# EasyEDA schematic GreenHouse BOX.json
TITLE: Sheet_1; REV: 1.0; Date: 2021-05-11; Sheet: 1/1; Company: Your Company
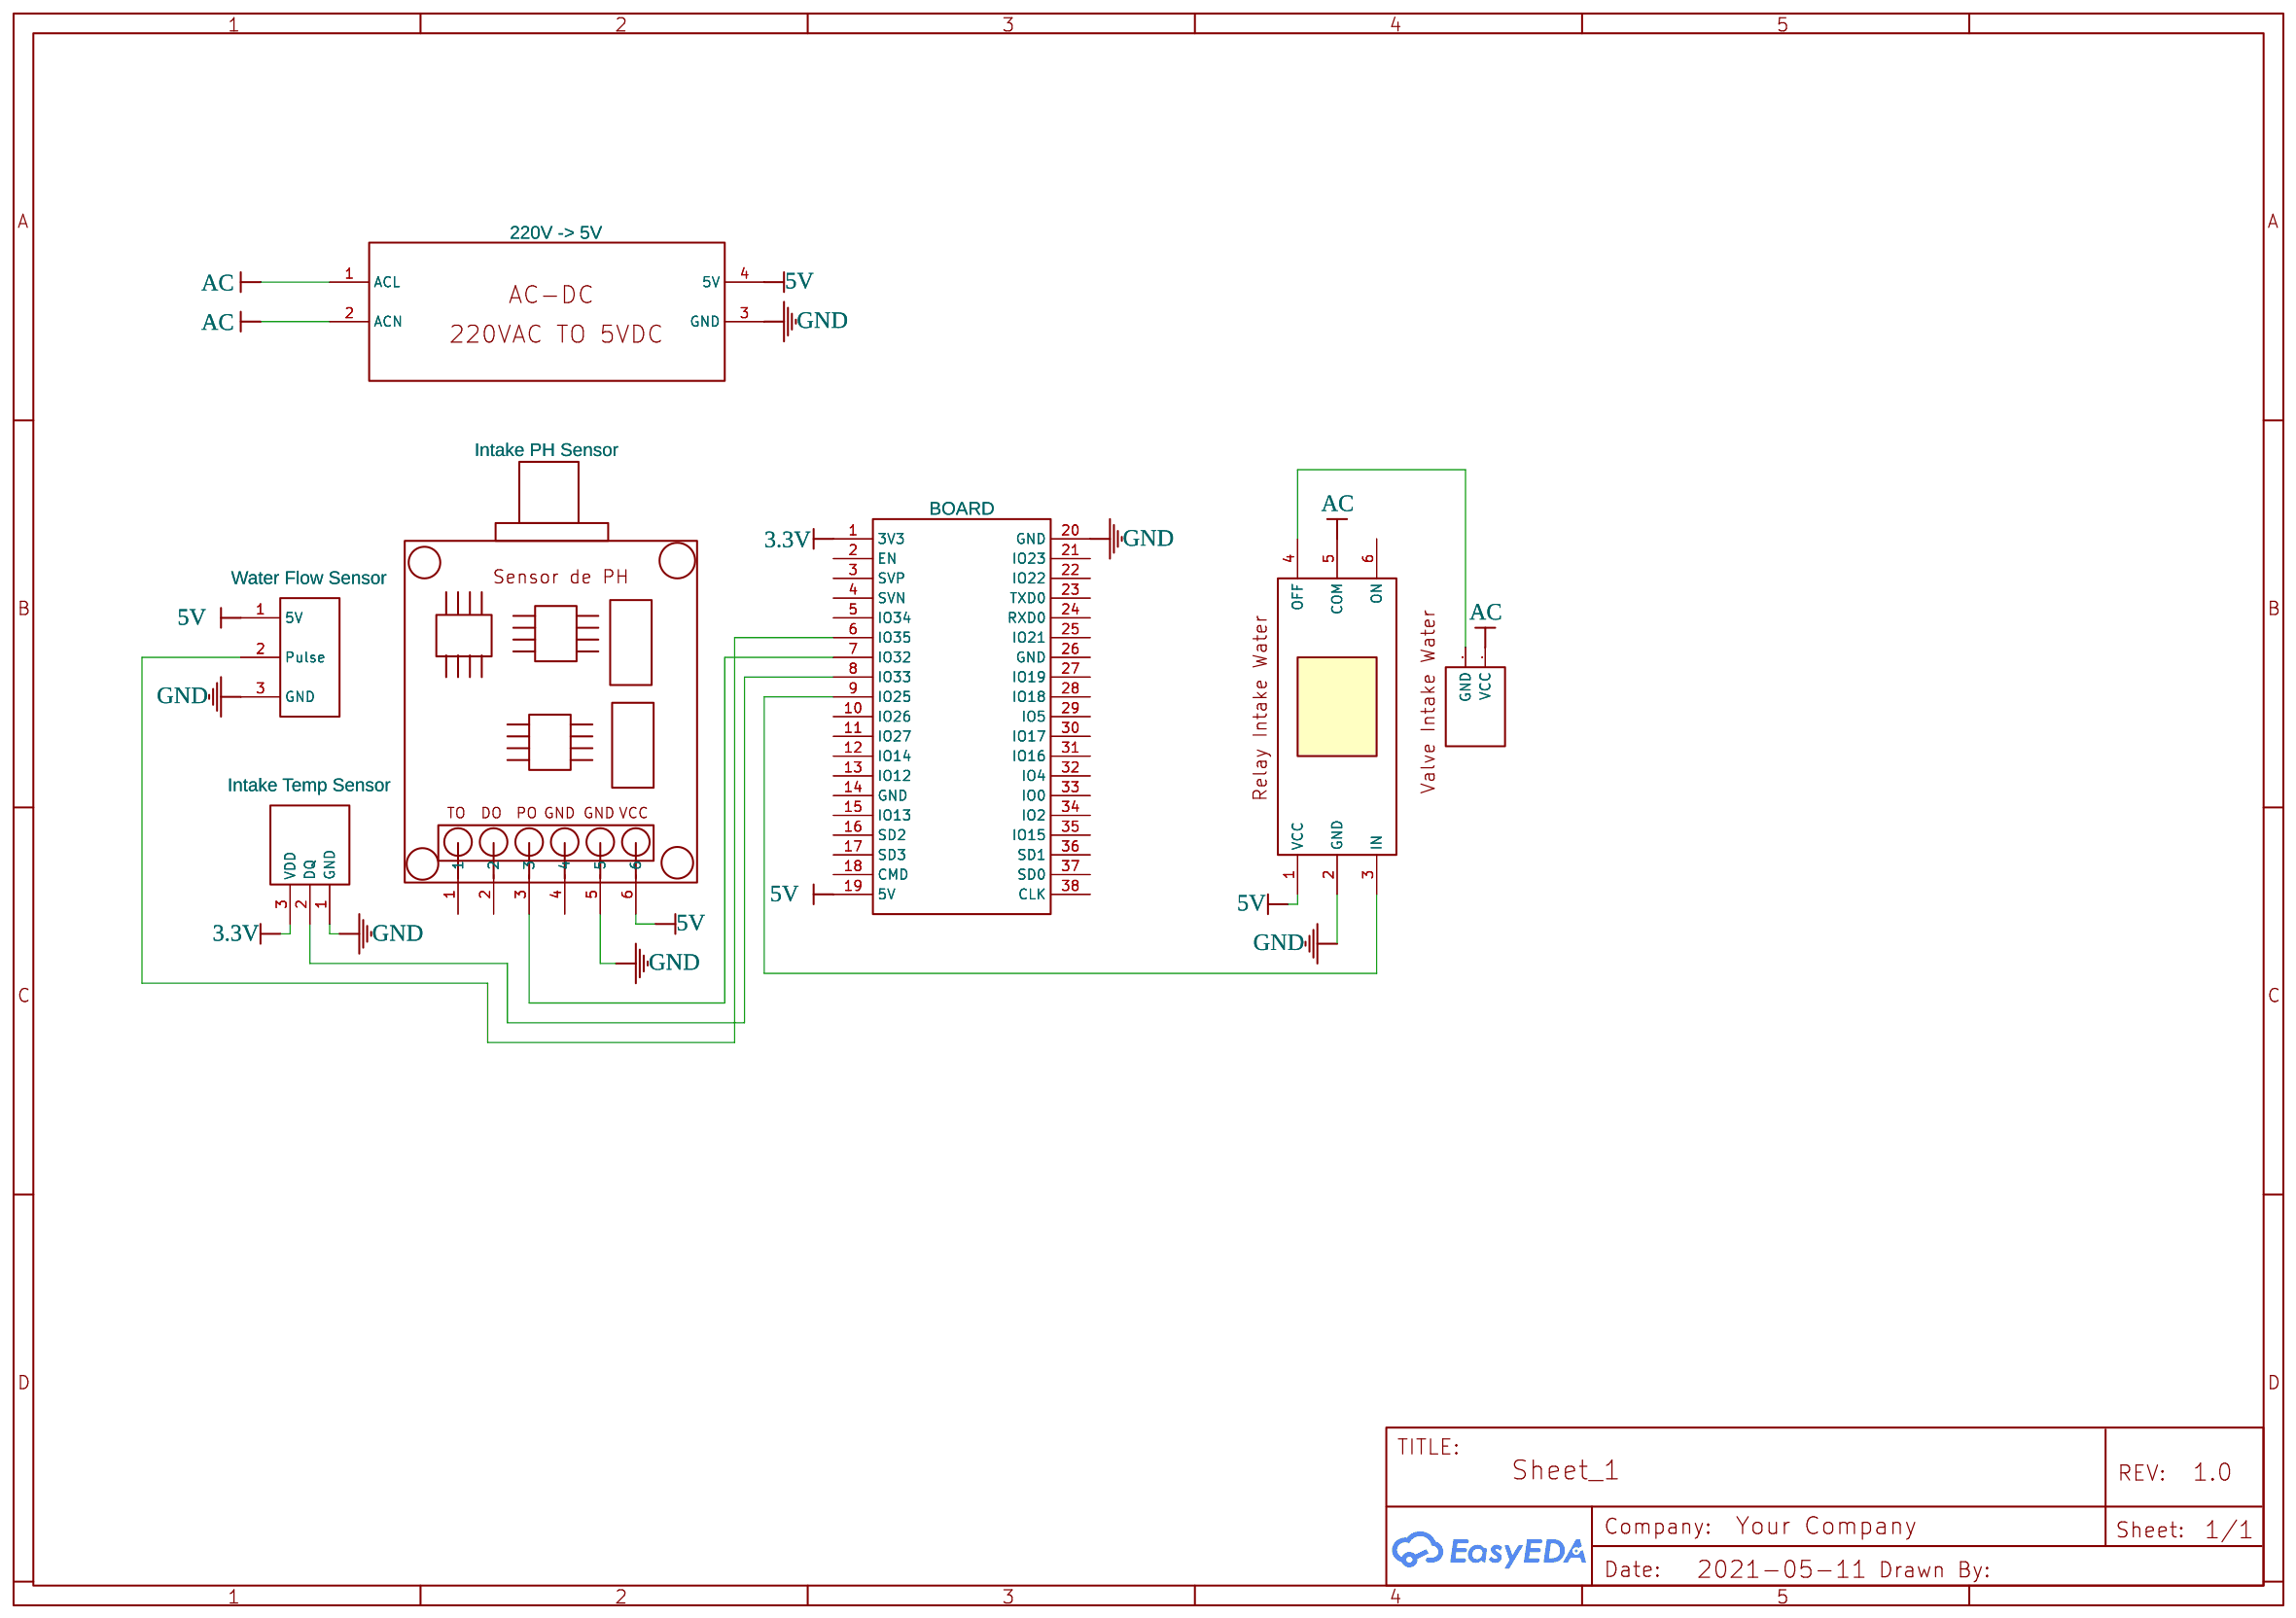
[diagram p0: schematic sheet]

## Parts
BOARD  ESP32  [ESP32]
BT1FF  Intake Temp Sensor  [DS18B20 (TO-92) 3PIN EASY PLANT]
P1  Solenoid Valve  [SOLENOID VALVE]
U1  Intake PH Sensor  [1X6_2.54MM_HEADER_AVR_ISP]
U2  220V -> 5V  [220VAC_TO_5VDC]
U3  Arduino Relay 5V 1CH 2LED  [ARDUINO RELAY 5V 1CH 2LED]
U4  Water Flow Sensor  [WATER_FLOW_SENSOR]

## Library data of the parts
BOARD = ESP32: Contributor: Ariusz
BT1FF = DS18B20: Supplier: LCSC; Manufacturer: MAXIM; Manufacturer Part: DS18B20+; image: //image.lceda.cn/szlcsc/C9753.jpg; Supplier Part: C9753; Contributor: 陳詩函
P1 = Solenoid Valve: Supplier Part: C49257; Manufacturer: BOOMELE; Manufacturer Part: Header2.54mm 1*3P; image: //image.lceda.cn/szlcsc/C49257.jpg; Contributor: valinotech
U1 = PH Sensor: Manufacturer Part: New SchematicLib; Contributor: Mychailo; Supplier: DFROBOT
U2 = ACDC_220V_5V: Contributor: nunocv
U3 = Arduino Relay 5V 1CH 2LED: Manufacturer Part: Relay module for Arduino; Contributor: Олег Бейдик
U4 = Water_flow_sensor: Contributor: hlouren

## Nets
3.3V: BOARD.1(3V3) BT1FF.3(VDD)
5V: BOARD.19(5V) U1.6 U2.4(5V) U3.1(VCC) U4.1(5V)
GND: BOARD.20(GND) BT1FF.1(GND) U1.5 U2.3(GND) U3.2(GND) U4.3(GND)
AC: P1.1(VCC) U2.1(ACL) U2.2(ACN) U3.5(COM)
Net-(BOARD-6): BOARD.6(IO35) U4.2(Pulse)
Net-(BOARD-7): BOARD.7(IO32) U1.3
Net-(BOARD-8): BOARD.8(IO33) BT1FF.2(DQ)
Net-(BOARD-9): BOARD.9(IO25) U3.3(IN)
Net-(P1-2): P1.2(GND) U3.4(OFF)

Not connected (* = marked no-connect by the designer): BOARD 2(EN) 3(SVP) 4(SVN) 5(IO34) 10(IO26) 11(IO27) 12(IO14) 13(IO12) 14(GND) 15(IO13) 16(SD2) 17(SD3) 18(CMD) 21(IO23) 22(IO22) 23(TXD0) 24(RXD0) 25(IO21) 26(GND) 27(IO19) 28(IO18) 29(IO5) 30(IO17) 31(IO16) 32(IO4) 33(IO0) 34(IO2) 35(IO15) 36(SD1) 37(SD0) 38(CLK); U1 1 2 4; U3 6(ON)
